# EAGLE design layoutprocessadorsch (EAGLE 9.0.0)
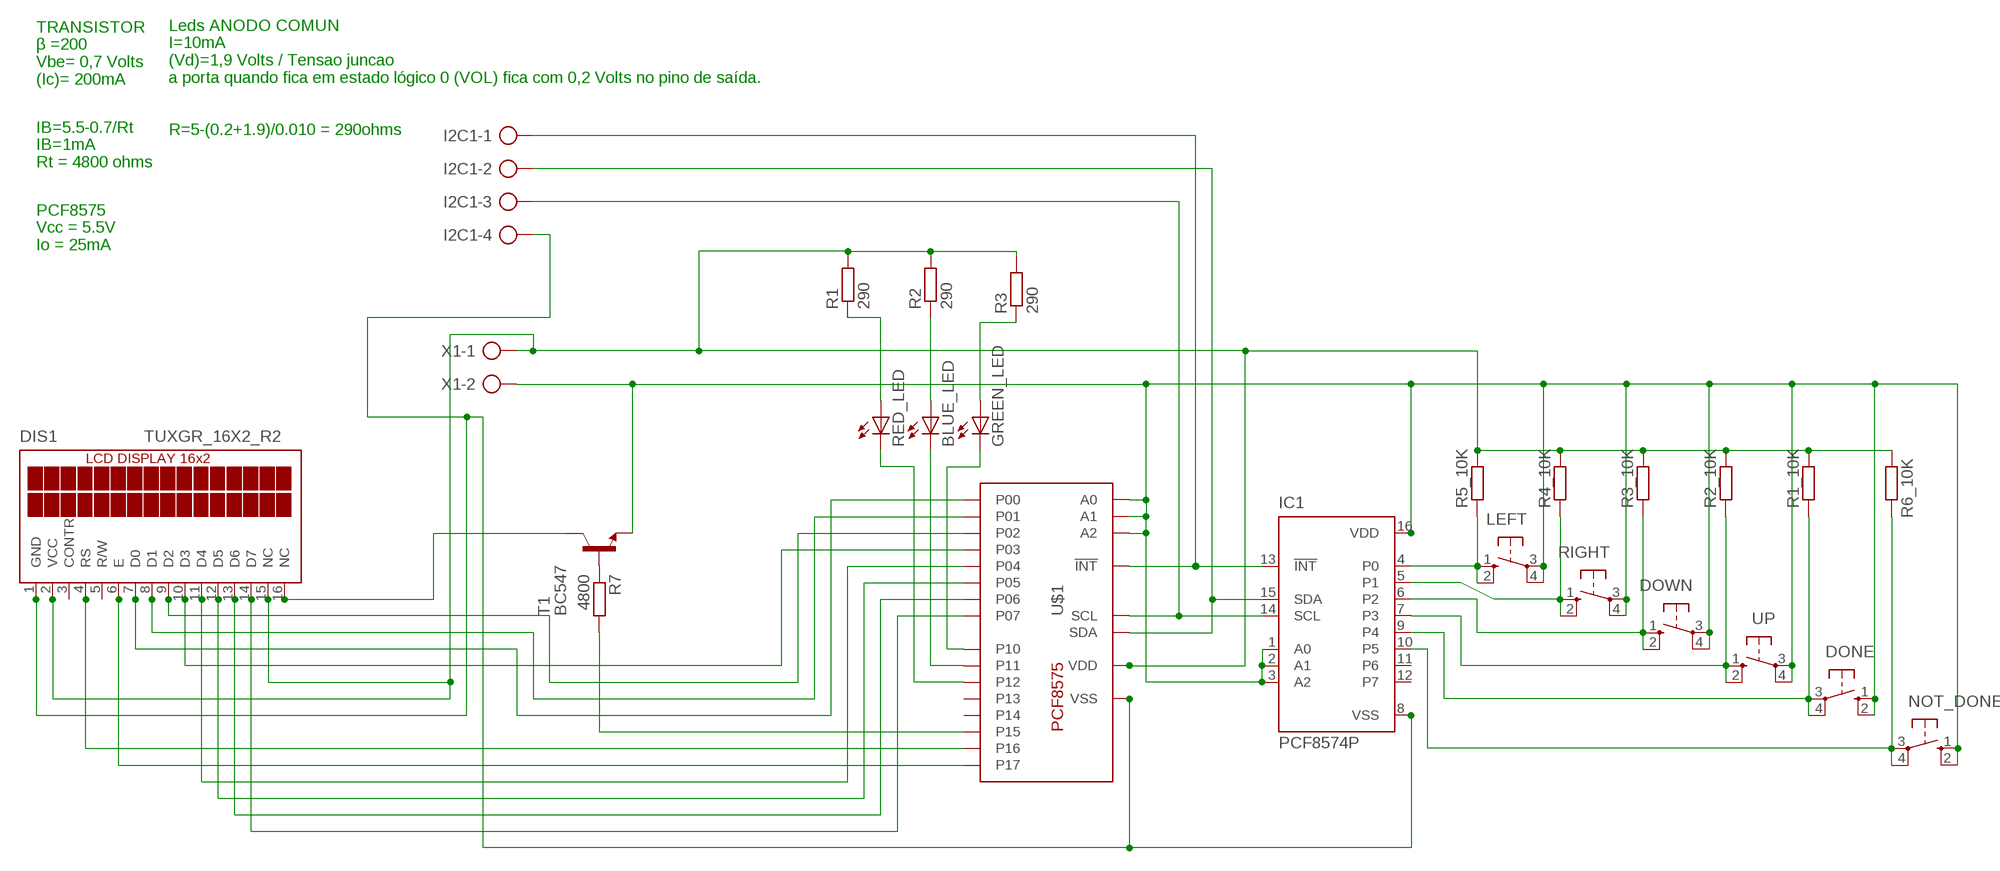
[diagram p0: schematic, sheet 1]

## Parts
BLUE_LED  LED5MM  [LED5MM]
DIS1  TUXGR_16X2_R2  [TUXGR_16X2_R2]
DONE  10-XX  [B3F-10XX]
DOWN  10-XX  [B3F-10XX]
GREEN_LED  LED5MM  [LED5MM]
I2C1  AK500/4-H  [AK500/4-H]
IC1  PCF8574P  [DIL16]
LEFT  10-XX  [B3F-10XX]
NOT_DONE  10-XX  [B3F-10XX]
R1  290  R-EU_0207/7  [0207/7]
R1_10K  R-EU_0207/7  [0207/7]
R2  290  R-EU_0207/7  [0207/7]
R2_10K  R-EU_0207/7  [0207/7]
R3  290  R-EU_0207/7  [0207/7]
R3_10K  R-EU_0207/7  [0207/7]
R4_10K  R-EU_0207/7  [0207/7]
R5_10K  R-EU_0207/7  [0207/7]
R6_10K  R-EU_0207/7  [0207/7]
R7  4800  R-EU_0207/7  [0207/7]
RED_LED  LED5MM  [LED5MM]
RIGHT  10-XX  [B3F-10XX]
T1  BC547  [TO92]
U$1  PCF8575C  [SOP24]
UP  10-XX  [B3F-10XX]
X1  AK500/2-H  [AK500/2-H]

## Nets
N$1: DIS1.14(D7) U$1.P$11(P07)
N$2: R7.1 T1.2(B)
N$3: I2C1.1 IC1.13(!INT) U$1.P$1(!INT)
N$4: I2C1.2 IC1.15(SDA) U$1.P$23(SDA)
N$5: DIS1.7(D0) U$1.P$4(P00)
N$6: DIS1.8(D1) U$1.P$5(P01)
N$7: DIS1.9(D2) U$1.P$6(P02)
N$8: DIS1.10(D3) U$1.P$7(P03)
N$9: DIS1.1(GND) I2C1.4 IC1.8(VSS) U$1.P$12(VSS)
N$10: DIS1.6(E) U$1.P$20(P17)
N$11: DIS1.4(RS) U$1.P$19(P16)
N$12: I2C1.3 IC1.14(SCL) U$1.P$22(SCL)
N$13: DIS1.11(D4) U$1.P$8(P04)
N$14: DIS1.12(D5) U$1.P$9(P05)
N$15: DIS1.13(D6) U$1.P$10(P06)
N$16: R7.2 U$1.P$18(P15)
N$17: DIS1.16(NC) T1.3(C)
N$18: GREEN_LED.K(C) U$1.P$13(P10)
N$19: IC1.4(P0) LEFT.1(S) LEFT.2(S1) R5_10K.1
N$20: IC1.5(P1) R4_10K.1 RIGHT.1(S) RIGHT.2(S1)
N$22: DOWN.1(S) DOWN.2(S1) IC1.6(P2) R3_10K.1
N$23: DIS1.2(VCC) DIS1.15(NC) R1.2 R1_10K.2 R2.2 R2_10K.2 R3.2 R3_10K.2 R4_10K.2 R5_10K.2 R6_10K.1 U$1.P$24(VDD) X1.1
N$24: DONE.3(P) DONE.4(P1) IC1.9(P4) R1_10K.1
N$26: IC1.10(P5) NOT_DONE.3(P) NOT_DONE.4(P1) R6_10K.2
N$28: IC1.7(P3) R2_10K.1 UP.1(S) UP.2(S1)
N$29: BLUE_LED.K(C) U$1.P$14(P11)
N$30: RED_LED.K(C) U$1.P$15(P12)
N$31: R1.1 RED_LED.A
N$32: BLUE_LED.A R2.1
N$33: GREEN_LED.A R3.1
N$35: DONE.1(S) DONE.2(S1) DOWN.3(P) DOWN.4(P1) IC1.1(A0) IC1.2(A1) IC1.3(A2) IC1.16(VDD) LEFT.3(P) LEFT.4(P1) NOT_DONE.1(S) NOT_DONE.2(S1) RIGHT.3(P) RIGHT.4(P1) T1.1(E) U$1.P$2(A1) U$1.P$3(A2) U$1.P$21(A0) UP.3(P) UP.4(P1) X1.2
Unconnected: DIS1.3(CONTR) DIS1.5(R/W) IC1.11(P6) IC1.12(P7) U$1.P$16(P13) U$1.P$17(P14)

## Notes on the sheet
- TRANSISTOR
  β =200
  Vbe= 0,7 Volts
  (Ic)= 200mA
- Leds ANODO COMUN
  I=10mA
  (Vd)=1,9 Volts / Tensao juncao
  a porta quando fica em estado lógico 0 (VOL) fica com 0,2 Volts no pino de saída.
  
  
  R=5-(0.2+1.9)/0.010 = 290ohms
- IB=5.5-0.7/Rt
  IB=1mA
  Rt = 4800 ohms
- PCF8575
  Vcc = 5.5V
  Io = 25mA

## Library data of the parts
BLUE_LED GREEN_LED RED_LED = led:LED: LED OSRAM: - CHIPLED LG R971, LG N971, LY N971, LG Q971, LY Q971, LO R971, LY R971 LH N974, LH R974 LS Q976, LO Q976, LY Q976 LO Q996 - Hyper CHIPLED LW Q18S LB Q993, LB Q99A, LB R99A - SideLED LS A670, LO A670, LY A670, LG A670, LP A670 LB A673, LV A673, LT A673, LW A673 LH A674 LY A675 LS A676, LA A676, LO A676, LY A676, LW A676 LS A679, LY A679, LG A679 - Hyper Micro SIDELED® LS Y876, LA Y876, LO Y876, LY Y876 LT Y87S - SmartLED LW L88C, LW L88S LB L89C, LB L89S, LG L890 LS L89K, LO L89K, LY L89K LS L896, LA L896, LO L896, LY L896 - TOPLED LS T670, LO T670, LY T670, LG T670, LP T670 LSG T670, LSP T670, LSY T670, LOP T670, LYG T670 LG T671, LOG T671, LSG T671 LB T673, LV T673, LT T673, LW T673 LH T674 LS T676, LA T676, LO T676, LY T676, LB T676, LH T676, LSB T676, LW T676 LB T67C, LV T67C, LT T67C, LS T67K, LO T67K, LY T67K, LW E67C LS E67B, LA E67B, LO E67B, LY E67B, LB E67C, LV E67C, LT E67C LW T67C LS T679, LY T679, LG T679 LS T770, LO T770, LY T770, LG T770, LP T770 LB T773, LV T773, LT T773, LW T773 LH T774 LS E675, LA E675, LY E675, LS T675 LS T776, LA T776, LO T776, LY T776, LB T776 LHGB T686 LT T68C, LB T68C - Hyper Mini TOPLED® LB M676 - Mini TOPLED Santana® LG M470 LS M47K, LO M47K, LY M47K Source: http://www.osram.convergy.de LUXEON: - LUMILED® LXK2-PW12-R00, LXK2-PW12-S00, LXK2-PW14-U00, LXK2-PW14-V00 LXK2-PM12-R00, LXK2-PM12-S00, LXK2-PM14-U00 LXK2-PE12-Q00, LXK2-PE12-R00, LXK2-PE12-S00, LXK2-PE14-T00, LXK2-PE14-U00 LXK2-PB12-K00, LXK2-PB12-L00, LXK2-PB12-M00, LXK2-PB14-N00, LXK2-PB14-P00, LXK2-PB14-Q00 LXK2-PR12-L00, LXK2-PR12-M00, LXK2-PR14-Q00, LXK2-PR14-R00 LXK2-PD12-Q00, LXK2-PD12-R00, LXK2-PD12-S00 LXK2-PH12-R00, LXK2-PH12-S00 LXK2-PL12-P00, LXK2-PL12-Q00, LXK2-PL12-R00 Source: www.luxeon.com KINGBRIGHT: KA-3528ASYC Source: www.kingbright.com
DIS1 = display-lcd:TUXGR_16X2_R2: Tuxgraphics LCD display 16x2 characters reflective, without background light Source: tuxgr_12x2_r2.pdf; OC_FARNELL: unknown; OC_NEWARK: unknown
DONE DOWN LEFT NOT_DONE RIGHT UP = switch-omron:10-XX: OMRON SWITCH; MPN: B3F-1000; OC_FARNELL: 176432; OC_NEWARK: 36M3542
I2C1 = con-ptr500:AK500/4-H: CONNECTOR Aug. 2004 / PTR Meßtechnik: Die Bezeichnung der Serie AK505 wurde geändert. Es handelt sich hierbei um AK500 in horizontaler Ausführung.; OC_FARNELL: unknown; OC_NEWARK: unknown
IC1 = micro-philips:PCF8574: I2C-Bus Remote 8-bit I/O expander http://www.semiconductors.philips.com/acrobat_download/datasheets/PCF8574_4.pdf; MPN: PCF8574PN; OC_FARNELL: 204020; OC_NEWARK: 11N8515; SPICEPREFIX: X
R1-R3 = resistor:R-EU_: RESISTOR, European symbol
R1_10K R2_10K R3_10K R4_10K R5_10K R6_10K R7 = rcl:R-EU_: RESISTOR, European symbol; SPICEPREFIX: R
T1 = transistor:BC547: NPN TRANSISTOR
U$1 = pcf8575c:PCF8575C
X1 = con-ptr500:AK500/2-H: CONNECTOR Aug. 2004 / PTR Meßtechnik: Die Bezeichnung der Serie AK505 wurde geändert. Es handelt sich hierbei um AK500 in horizontaler Ausführung.; OC_FARNELL: unknown; OC_NEWARK: unknown

## Board
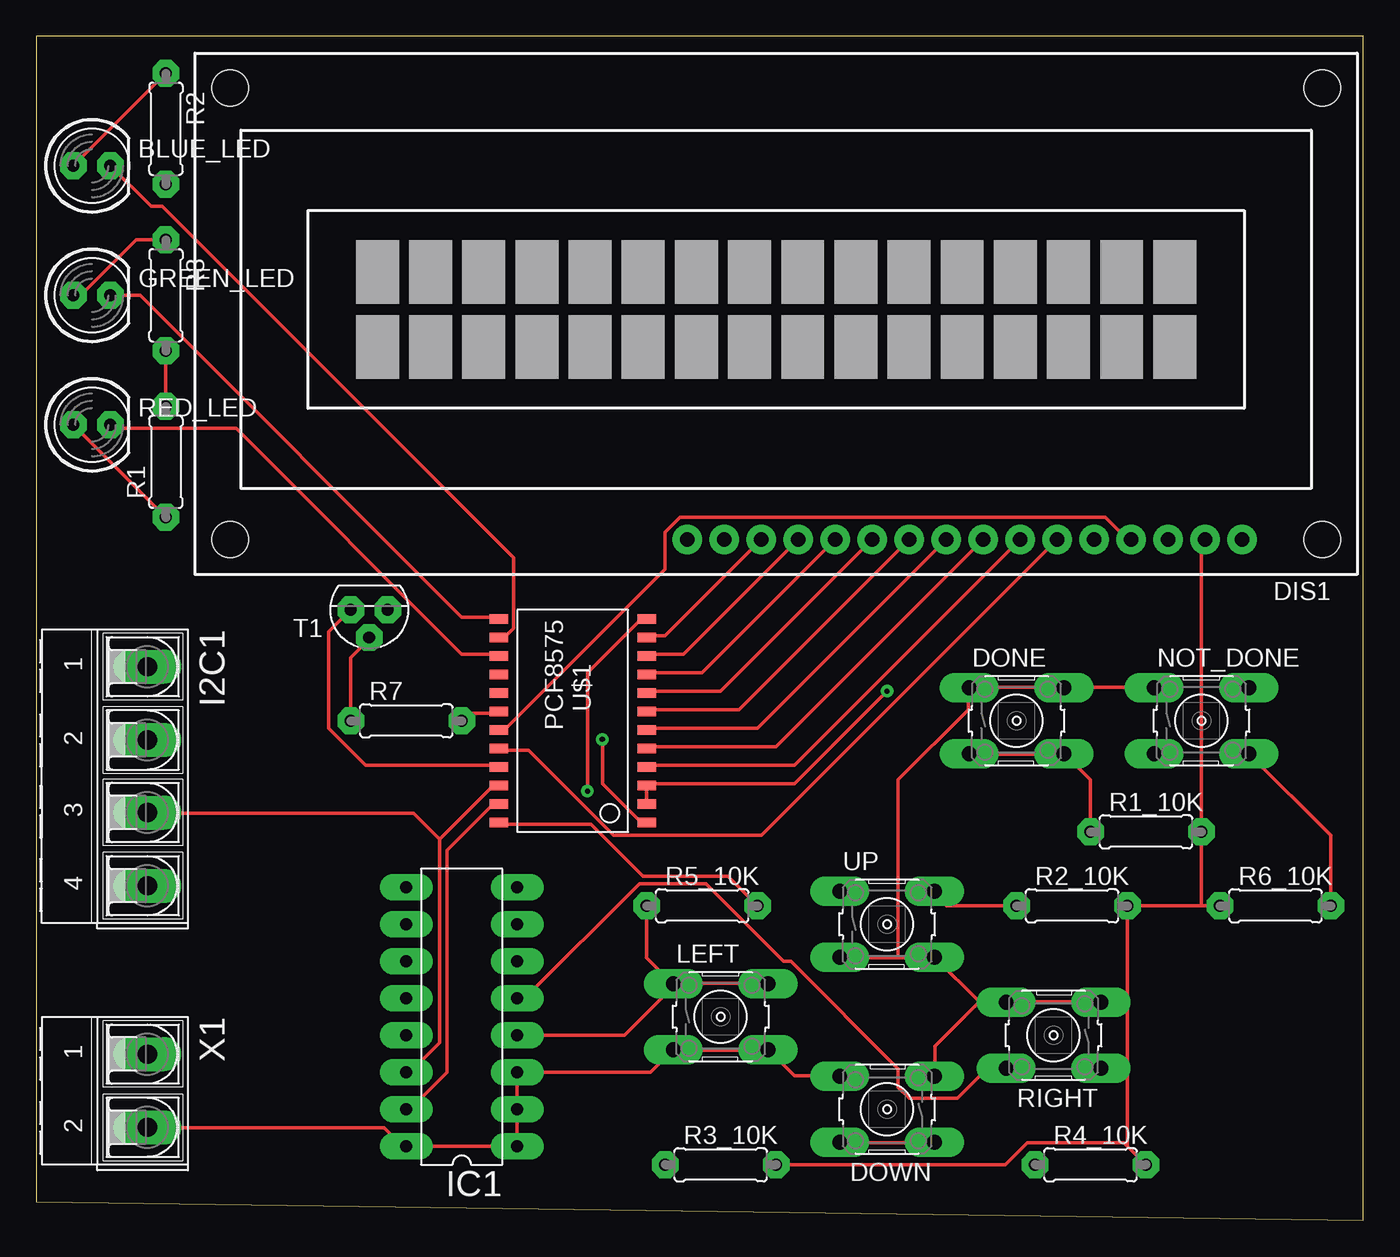
[diagram p1: board, top side]
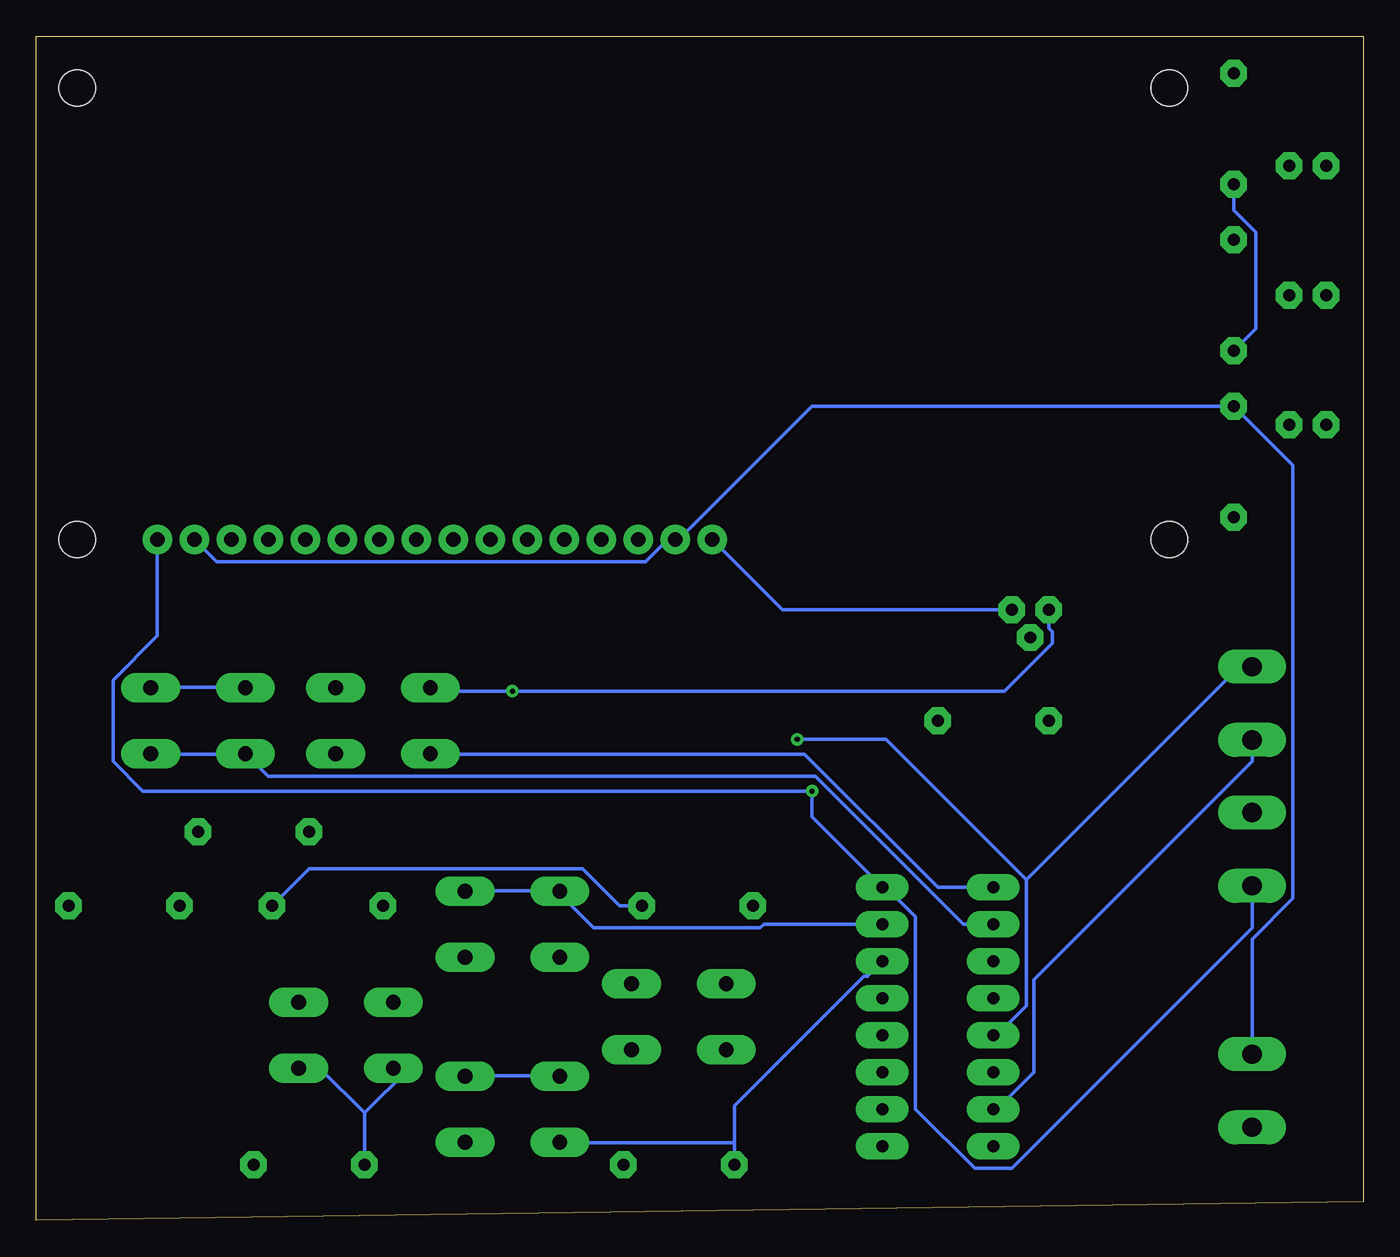
[diagram p2: board, bottom side, seen from below]

Size 91.11 x 81.27 mm. Coordinates in mm from the lower left corner, seen from the top.
Outline: 0,1.27 91.11,0 91.11,81.27 0,81.27 0,1.27
Copper layers (1*16): Top 0.035mm / dielectric 1.5mm / Bottom 0.035mm
Design rules "default *": minimum track width 10mil, minimum drill 0.35mm, track to track 10mil, track to pad 10mil, pad to pad 10mil, via to via 10mil, smd to smd 10mil, copper to edge 40mil, drill to drill 6mil, minimum pad ring 20mil, minimum via ring 10mil, stop-mask expansion 4mil, vias tented up to drill 0mil, thermal gap 10mil

### Footprints (pad centres in the part's own frame; a part is rotated, then mirrored left to right if it is on the bottom)
LED5MM = drill 0.813 octagon: A -1.27,0; K 1.27,0
TUXGR_16X2_R2 = drill 1 pad 1.676: 1 -32,15.5; 2 -29.46,15.5; 3 -26.92,15.5; 4 -24.38,15.5; 5 -21.84,15.5; 6 -19.3,15.5; 7 -16.76,15.5; 8 -14.22,15.5; 9 -11.68,15.5; 10 -9.14,15.5; 11 -6.6,15.5; 12 -4.06,15.5; 13 -1.52,15.5; 14 1.02,15.5; 15 3.56,15.5; 16 6.1,15.5 | hole 2.5: -37.5,-15.5; 37.5,-15.5; -37.5,15.5; 37.5,15.5
B3F-10XX = drill 1.016 long: 1 -3.251,2.261; 2 3.251,2.261; 3 -3.251,-2.261; 4 3.251,-2.261
AK500/4-H = drill 1.321 long: 1 -7.518,0; 2 -2.489,0; 3 2.489,0; 4 7.518,0
DIL16 = drill 0.813 long: 1 -8.89,-3.81; 2 -6.35,-3.81; 3 -3.81,-3.81; 4 -1.27,-3.81; 5 1.27,-3.81; 6 3.81,-3.81; 7 6.35,-3.81; 8 8.89,-3.81; 9 8.89,3.81; 10 6.35,3.81; 11 3.81,3.81; 12 1.27,3.81; 13 -1.27,3.81; 14 -3.81,3.81; 15 -6.35,3.81; 16 -8.89,3.81
0207/7 = drill 0.813 octagon: 1 -3.81,0; 2 3.81,0
TO92 = drill 0.813 octagon: 1 1.27,0; 2 0,1.905; 3 -1.27,0
SOP24 = smd 1.27 x 0.635: P$1 -1.27,14.605; P$2 -1.27,13.335; P$3 -1.27,12.065; P$4 -1.27,10.795; P$5 -1.27,9.525; P$6 -1.27,8.255; P$7 -1.27,6.985; P$8 -1.27,5.715; P$9 -1.27,4.445; P$10 -1.27,3.175; P$11 -1.27,1.905; P$12 -1.27,0.635; P$13 8.89,0.635; P$14 8.89,1.905; P$15 8.89,3.175; P$16 8.89,4.445; P$17 8.89,5.715; P$18 8.89,6.985; P$19 8.89,8.255; P$20 8.89,9.525; P$21 8.89,10.795; P$22 8.89,12.065; P$23 8.89,13.335; P$24 8.89,14.605
AK500/2-H = drill 1.321 long: 1 -2.515,0; 2 2.515,0

### Placement (x,y rotation side)
BLUE_LED  3.81,72.39 0 top
DIS1  50.8,62.23 180 top
DONE  67.31,34.29 0 top
DOWN  58.42,7.62 180 top
GREEN_LED  3.81,63.5 0 top
I2C1  7.62,30.48 270 top
IC1  29.21,13.97 90 top
LEFT  46.99,13.97 0 top
NOT_DONE  80.01,34.29 0 top
R1  8.89,52.07 90 top
R1_10K  76.2,26.67 0 top
R2  8.89,74.93 270 top
R2_10K  71.12,21.59 0 top
R3  8.89,63.5 270 top
R3_10K  46.99,3.81 0 top
R4_10K  72.39,3.81 0 top
R5_10K  45.72,21.59 0 top
R6_10K  85.09,21.59 0 top
R7  25.4,34.29 0 top
RED_LED  3.81,54.61 0 top
RIGHT  69.85,12.7 180 top
T1  22.86,41.91 180 top
U$1  40.64,41.91 180 top
UP  58.42,20.32 0 top
X1  7.62,8.89 270 top

### Tracks (layer width: path | path; a pad name or v marks a point on that pad's centre or on a via)
N$1
  Top 0.254: U$1.P$11 41.91,40.13 43.18,40.13 49.53,46.48 DIS1.14
N$2
  Top 0.254: R7.1 21.59,38.61 22.86,39.88 T1.2
N$3  (via drill 0.35)
  Top 0.254: v38.86,33.02 38.86,29.97 41.4,27.43 41.91,27.43 U$1.P$1
  Bottom 0.254: v38.86,33.02 32.77,33.02 23.11,23.37 | 23.11,23.37 23.11,14.73 25.15,12.7 IC1.13 | 23.11,23.37 8.64,37.85 7.62,37.85 I2C1.1
N$4
  Top 0.254: IC1.15 25.65,7.62 28.19,10.16 28.19,25.4 31.24,28.45 31.75,28.45 U$1.P$23
  Bottom 0.254: I2C1.2 7.62,31.5 22.61,16.51 22.61,10.16 25.15,7.62 IC1.15
N$5
  Top 0.254: U$1.P$4 41.91,31.24 52.07,31.24 67.31,46.48 DIS1.7
N$6
  Top 0.254: U$1.P$5 41.91,32.51 50.8,32.51 64.77,46.48 DIS1.8
N$7
  Top 0.254: U$1.P$6 41.91,33.78 49.53,33.78 62.23,46.48 DIS1.9
N$8
  Top 0.254: U$1.P$7 41.91,35.05 48.26,35.05 59.69,46.48 DIS1.10
N$9  (via drill 0.35)
  Top 0.254: v37.85,29.46 37.85,37.59 41.4,41.15 41.91,41.15 U$1.P$12
  Bottom 0.254: DIS1.1 82.8,46.48 82.8,40.13 85.85,37.08 85.85,31.5 83.82,29.46 v37.85,29.46 37.85,27.69 IC1.8 32.77,22.86 30.73,20.83 30.73,7.62 26.67,3.56 24.13,3.56 7.62,20.07 I2C1.4
N$10
  Top 0.254: U$1.P$20 31.75,32.26 33.78,32.26 39.62,26.42 49.78,26.42 69.85,46.48 DIS1.6
N$11
  Top 0.254: U$1.P$19 31.75,33.78 32.26,33.78 43.18,44.7 43.18,47.24 44.2,48.26 73.41,48.26 74.93,46.74 DIS1.4
N$12
  Top 0.254: 27.69,26.16 31.24,29.72 31.75,29.72 U$1.P$22 | 27.69,26.16 27.69,12.19 25.65,10.16 IC1.14 | 27.69,26.16 25.91,27.94 7.62,27.94 I2C1.3
N$13
  Top 0.254: U$1.P$8 41.91,36.32 46.99,36.32 57.15,46.48 DIS1.11
N$14
  Top 0.254: U$1.P$9 41.91,37.59 45.72,37.59 54.61,46.48 DIS1.12
N$15
  Top 0.254: U$1.P$10 41.91,38.86 44.45,38.86 52.07,46.48 DIS1.13
N$16
  Top 0.254: R7.2 29.72,34.8 31.75,34.8 U$1.P$18
N$17
  Bottom 0.254: T1.3 39.88,41.91 44.45,46.48 DIS1.16
N$18
  Top 0.254: GREEN_LED.K 7.11,63.5 29.21,41.4 31.75,41.4 U$1.P$13
N$19
  Top 0.254: IC1.4 40.39,12.7 43.69,16 LEFT.1 | R5_10K.1 41.91,18.03 43.69,16.26 LEFT.1 | LEFT.2 50.04,16.26 43.94,16.26 LEFT.1
N$20
  Top 0.254: IC1.5 33.53,15.24 41.4,23.11 45.97,23.11 51.31,17.78 51.82,17.78 59.18,10.41 59.18,9.14 59.94,8.38 63.25,8.38 65.28,10.41 RIGHT.2
  Bottom 0.254: 68.58,7.37 R4_10K.1 | 68.58,7.37 65.53,10.41 RIGHT.2 | 68.58,7.37 71.63,10.41 RIGHT.1
N$22
  Top 0.254: DOWN.2 55.37,5.33 61.47,5.33 DOWN.1
  Bottom 0.254: IC1.6 34.04,16.76 34.29,16.76 43.18,7.87 43.18,5.33 | R3_10K.1 43.18,5.33 | 43.18,5.33 55.12,5.33 DOWN.2
N$23
  Top 0.254: R3.2 R1.2 | R5_10K.2 47.5,23.62 41.66,23.62 38.1,27.18 31.75,27.18 U$1.P$24 | R6_10K.1 80.01,21.59 | 80.01,21.59 R2_10K.2 74.93,5.08 | 80.01,21.59 R1_10K.2 80.01,46.48 DIS1.2 | R3_10K.2 66.55,3.81 68.07,5.33 74.68,5.33 74.93,5.08 | R4_10K.2 74.93,5.08
  Bottom 0.254: R2.2 8.89,69.34 7.37,67.82 7.37,61.21 R3.2 | X1.1 7.62,19.3 4.83,22.1 4.83,51.82 R1.2 37.85,55.88 46.99,46.74 DIS1.15 47.24,46.48 48.01,46.48 49.28,45.21 78.74,45.21 80.01,46.48 DIS1.2 | R5_10K.2 51.05,21.59 53.59,24.13 72.39,24.13 R2_10K.2
N$24
  Top 0.254: R1_10K.1 72.39,30.23 70.61,32 DONE.4 70.36,32 64.26,32 DONE.3
  Bottom 0.254: IC1.9 29.21,22.86 38.35,32 64.01,32 DONE.3
N$26
  Top 0.254: R6_10K.2 88.9,26.42 83.31,32 NOT_DONE.4
  Bottom 0.254: IC1.10 27.43,20.32 37.59,30.48 75.18,30.48 76.71,32 NOT_DONE.3 76.96,32 83.06,32 NOT_DONE.4
N$28
  Top 0.254: R2_10K.1 62.48,21.59 61.72,22.35 UP.2
  Bottom 0.254: IC1.7 41.15,20.32 41.4,20.07 52.83,20.07 55.12,22.35 UP.1 55.37,22.61 61.47,22.61 UP.2
N$29
  Top 0.254: BLUE_LED.K 7.87,69.6 8.64,69.6 32.77,45.47 32.77,40.64 32.26,40.13 31.75,40.13 U$1.P$14
N$30
  Top 0.254: RED_LED.K 5.33,54.36 13.72,54.36 29.21,38.86 31.75,38.86 U$1.P$15
N$31
  Top 0.254: R1.1 RED_LED.A
N$32
  Top 0.254: R2.1 BLUE_LED.A
N$33
  Top 0.254: GREEN_LED.A 3.05,63.5 6.86,67.31 R3.1
N$35  (via drill 0.35)
  Top 0.254: T1.1 20.07,40.39 20.07,33.78 22.61,31.24 31.75,31.24 U$1.P$21 | NOT_DONE.1 76.71,36.58 70.61,36.58 DONE.2 70.36,36.58 64.26,36.58 DONE.1 64.01,36.32 64.01,35.05 59.18,30.23 59.18,18.03 | U$1.P$2 U$1.P$3 41.91,29.97 52.07,29.97 v58.42,36.32 | X1.2 7.62,6.35 23.88,6.35 25.15,5.08 IC1.16 IC1.1 IC1.2 IC1.3 42.16,10.16 43.69,11.68 LEFT.3 43.94,11.68 50.04,11.68 LEFT.4 50.29,11.68 52.07,9.91 55.12,9.91 DOWN.4 | 59.18,18.03 61.47,18.03 UP.4 61.72,18.03 64.77,14.99 | 59.18,18.03 55.37,18.03 UP.3 | 64.77,14.99 65.28,14.99 RIGHT.4 | RIGHT.3 71.63,14.99 65.53,14.99 RIGHT.4 | 64.77,14.99 61.72,11.94 61.72,9.91 DOWN.3 | 64.77,14.99 RIGHT.4
  Bottom 0.254: NOT_DONE.2 83.06,36.58 76.96,36.58 NOT_DONE.1 | DONE.1 64.01,36.32 v58.42,36.32 24.64,36.32 21.34,39.62 21.34,40.39 21.59,40.64 T1.1 | DOWN.3 61.47,9.91 55.37,9.91 DOWN.4